# EAGLE design fonte (EAGLE 9.6.2)
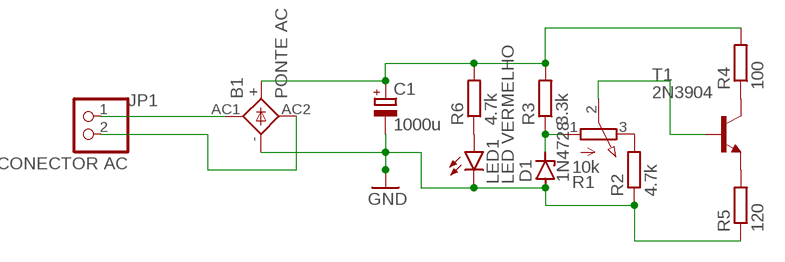
[diagram p0: schematic, sheet 1]

## Parts
B1  PONTE AC  1KAB  [1KAB]
C1  1000u  CPOL-EUE5-10.5  [E5-10,5]
D1  1N4728  [DO41Z10]
JP1  CONECTOR AC  PINHD-1X2  [1X02]
LED1  LED VERMELHO  LED5MM  [LED5MM]
R1  10k  3RP/1610N  [3RP/1610N]
R2  4.7k  R-EU_0207/10  [0207/10]
R3  3.3k  R-EU_0207/10  [0207/10]
R4  100  R-EU_0207/10  [0207/10]
R5  120  R-EU_0207/10  [0207/10]
R6  4.7k  R-EU_0207/10  [0207/10]
T1  2N3904  [TO92]

## Nets
GND: B1.- C1.- D1.A LED1.K(C) R2.1 R5.1
N$1: B1.AC1 JP1.1
N$2: B1.AC2 JP1.2
N$3: B1.+ C1.+ R3.2 R4.2 R6.2
N$4: LED1.A R6.1
N$5: D1.C R1.1(A) R3.1
N$6: R1.3(E) R2.2
N$7: R1.2(S) T1.2(B)
N$8: R5.2 T1.3(E)
N$9: R4.1 T1.1(C)

## Library data of the parts
B1 = rectifier:1KAB: RECTIFIER grid 5,08 x 5,08 mm
C1 = rcl:CPOL-EU: POLARIZED CAPACITOR, European symbol; SPICEPREFIX: C
D1 = diode:1N4728: Z DIODE 3.3 V, 1W, 5 percent
JP1 = pinhead:PINHD-1X2: PIN HEADER
LED1 = led:LED: LED OSRAM: - CHIPLED LG R971, LG N971, LY N971, LG Q971, LY Q971, LO R971, LY R971 LH N974, LH R974 LS Q976, LO Q976, LY Q976 LO Q996 - Hyper CHIPLED LW Q18S LB Q993, LB Q99A, LB R99A - SideLED LS A670, LO A670, LY A670, LG A670, LP A670 LB A673, LV A673, LT A673, LW A673 LH A674 LY A675 LS A676, LA A676, LO A676, LY A676, LW A676 LS A679, LY A679, LG A679 - Hyper Micro SIDELED® LS Y876, LA Y876, LO Y876, LY Y876 LT Y87S - SmartLED LW L88C, LW L88S LB L89C, LB L89S, LG L890 LS L89K, LO L89K, LY L89K LS L896, LA L896, LO L896, LY L896 - TOPLED LS T670, LO T670, LY T670, LG T670, LP T670 LSG T670, LSP T670, LSY T670, LOP T670, LYG T670 LG T671, LOG T671, LSG T671 LB T673, LV T673, LT T673, LW T673 LH T674 LS T676, LA T676, LO T676, LY T676, LB T676, LH T676, LSB T676, LW T676 LB T67C, LV T67C, LT T67C, LS T67K, LO T67K, LY T67K, LW E67C LS E67B, LA E67B, LO E67B, LY E67B, LB E67C, LV E67C, LT E67C LW T67C LS T679, LY T679, LG T679 LS T770, LO T770, LY T770, LG T770, LP T770 LB T773, LV T773, LT T773, LW T773 LH T774 LS E675, LA E675, LY E675, LS T675 LS T776, LA T776, LO T776, LY T776, LB T776 LHGB T686 LT T68C, LB T68C - Hyper Mini TOPLED® LB M676 - Mini TOPLED Santana® LG M470 LS M47K, LO M47K, LY M47K Source: http://www.osram.convergy.de LUXEON: - LUMILED® LXK2-PW12-R00, LXK2-PW12-S00, LXK2-PW14-U00, LXK2-PW14-V00 LXK2-PM12-R00, LXK2-PM12-S00, LXK2-PM14-U00 LXK2-PE12-Q00, LXK2-PE12-R00, LXK2-PE12-S00, LXK2-PE14-T00, LXK2-PE14-U00 LXK2-PB12-K00, LXK2-PB12-L00, LXK2-PB12-M00, LXK2-PB14-N00, LXK2-PB14-P00, LXK2-PB14-Q00 LXK2-PR12-L00, LXK2-PR12-M00, LXK2-PR14-Q00, LXK2-PR14-R00 LXK2-PD12-Q00, LXK2-PD12-R00, LXK2-PD12-S00 LXK2-PH12-R00, LXK2-PH12-S00 LXK2-PL12-P00, LXK2-PL12-Q00, LXK2-PL12-R00 Source: www.luxeon.com KINGBRIGHT: KA-3528ASYC Source: www.kingbright.com
R1 = pot:3RP/1610N: 16mm Potentiometer one level Source: http://www.alphapotentiometers.net/html/16mm_pot_2.html
R2-R6 = rcl:R-EU_: RESISTOR, European symbol; SPICEPREFIX: R
T1 = transistor:2N3904: NPN TRANSISTOR

## Board
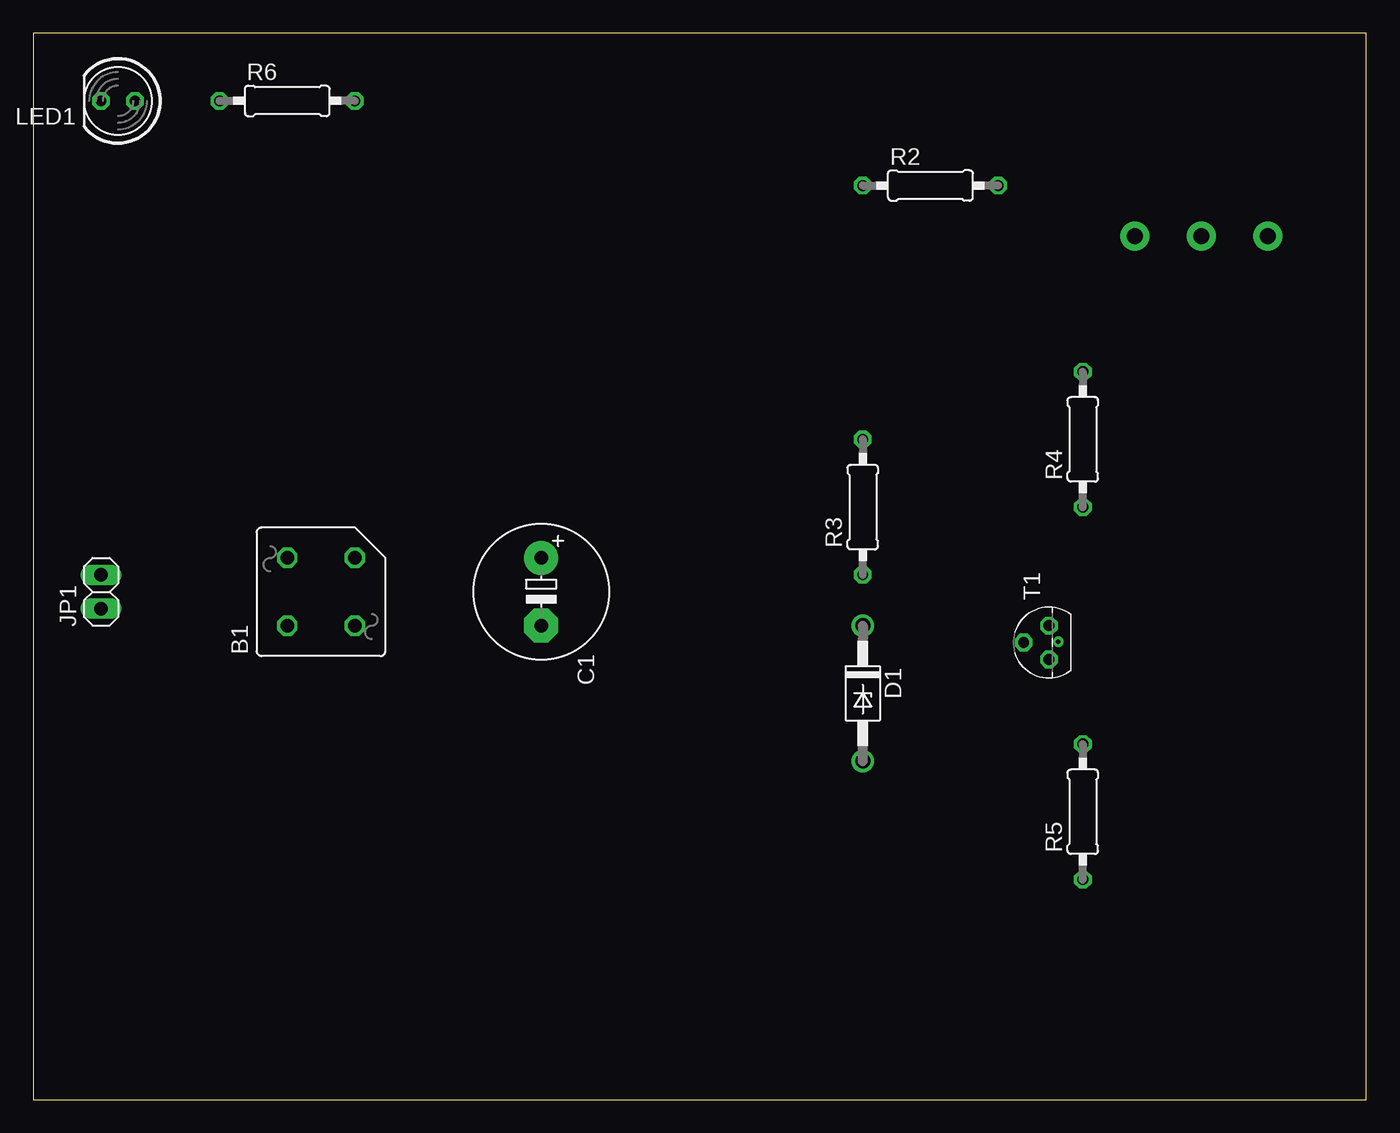
[diagram p1: board, top side]
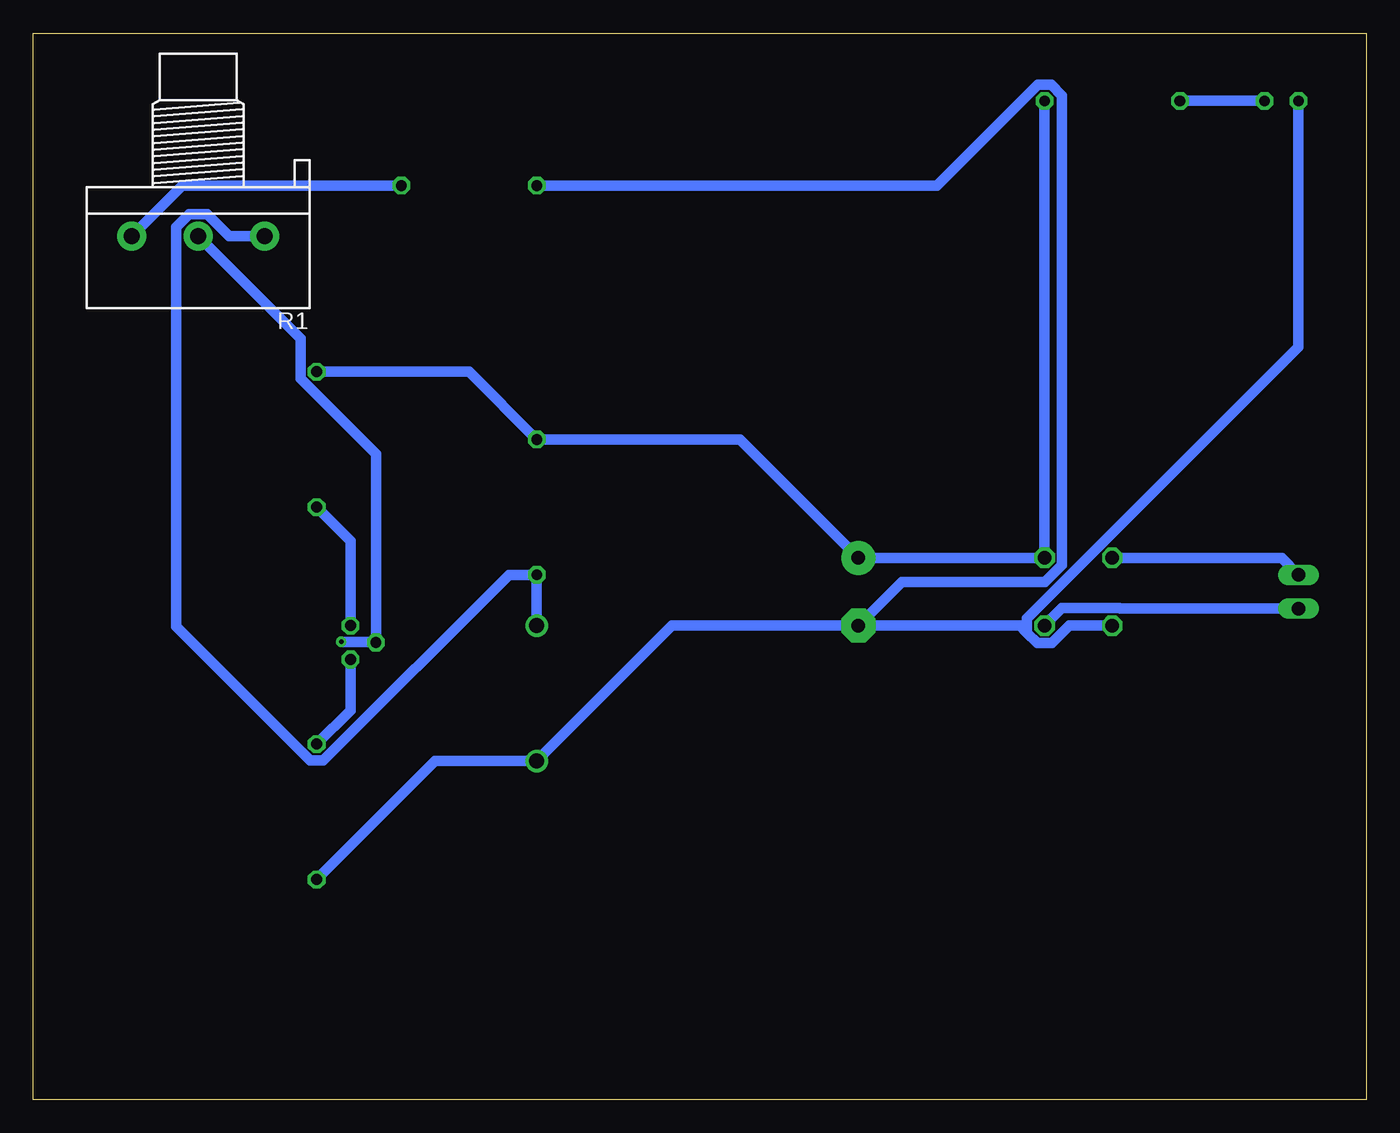
[diagram p2: board, bottom side, seen from below]

Size 100 x 80 mm. Coordinates in mm from the lower left corner, seen from the top.
Outline: 0,0 100,0 100,80 0,80 0,0
Copper layers (1*16): Top 0.035mm / dielectric 1.5mm / Bottom 0.035mm
Design rules "default": minimum track width 6mil, minimum drill 0.35mm, track to track 6mil, track to pad 6mil, pad to pad 6mil, via to via 6mil, smd to smd 6mil, copper to edge 40mil, drill to drill 6mil, minimum pad ring 10mil, minimum via ring 8mil, stop-mask expansion 4mil, vias tented up to drill 0mil, thermal gap 10mil

### Footprints (pad centres in the part's own frame; a part is rotated, then mirrored left to right if it is on the bottom)
1KAB = drill 1.016 octagon: + 2.54,-2.54; - -2.54,2.54; AC1 -2.54,-2.54; AC2 2.54,2.54
E5-10,5 = drill 1.016 pad 2.54: + -2.54,0 | drill 1.016 pad 2.54 octagon: - 2.54,0
DO41Z10 = drill 1.118: A 5.08,0; C -5.08,0
1X02 = drill 1.016 long: 1 -1.27,0; 2 1.27,0
LED5MM = drill 0.813 octagon: A -1.27,0; K 1.27,0
3RP/1610N = drill 1.2 pad 2.184: 1 -5,0; 2 0,0; 3 5,0
0207/10 = drill 0.813 octagon: 1 -5.08,0; 2 5.08,0
TO92 = drill 0.813 octagon: 1 1.27,0; 2 0,1.905; 3 -1.27,0

### Placement (x,y rotation side)
B1  21.59,38.1 90 top
C1  38.1,38.1 270 top
D1  62.23,30.48 270 top
JP1  5.08,38.1 90 top
LED1  6.35,74.93 180 top
R1  87.63,64.77 180 bottom
R2  67.31,68.58 0 top
R3  62.23,44.45 90 top
R4  78.74,49.53 90 top
R5  78.74,21.59 90 top
R6  19.05,74.93 0 top
T1  76.2,34.29 90 top

### Tracks (layer width: path | path; a pad name or v marks a point on that pad's centre or on a via)
GND
  Bottom 0.8: C1.- 25.99,35.56 25.44,35.02 | C1.- 52.07,35.56 D1.A 69.85,25.4 R5.1 | 25.44,35.02 24.67,34.25 23.59,34.25 22.27,35.56 B1.- | 25.44,35.02 25.44,36.1 5.08,56.47 LED1.K | R2.1 32.2,68.58 24.63,76.14 23.63,76.14 22.82,75.33 22.82,40.1 24.09,38.82 34.84,38.82 C1.-
N$1
  Bottom 0.8: JP1.1 18.46,36.83 18.51,36.87 22.82,36.87 B1.AC1
N$2
  Bottom 0.8: JP1.2 6.35,40.64 B1.AC2
N$3
  Bottom 0.8: R6.2 B1.+ C1.+ 46.99,49.53 R3.2 67.31,54.61 R4.2
N$4
  Bottom 0.8: LED1.A R6.1
N$5
  Bottom 0.8: D1.C R3.1 64.33,39.37 78.24,25.46 79.24,25.46 89.28,35.49 89.28,65.45 88.31,66.42 86.95,66.42 85.3,64.77 R1.1
N$6
  Bottom 0.8: R2.2 88.82,68.58 R1.3
N$7  (via drill 0.35)
  Bottom 0.8: v76.89,34.35 74.35,34.35 T1.2 74.3,48.45 79.95,54.11 79.95,57.09 R1.2
N$8
  Bottom 0.8: T1.3 76.2,29.21 R5.2
N$9
  Bottom 0.8: R4.1 76.2,41.91 T1.1